# Altium project SolderStation.PrjPCB
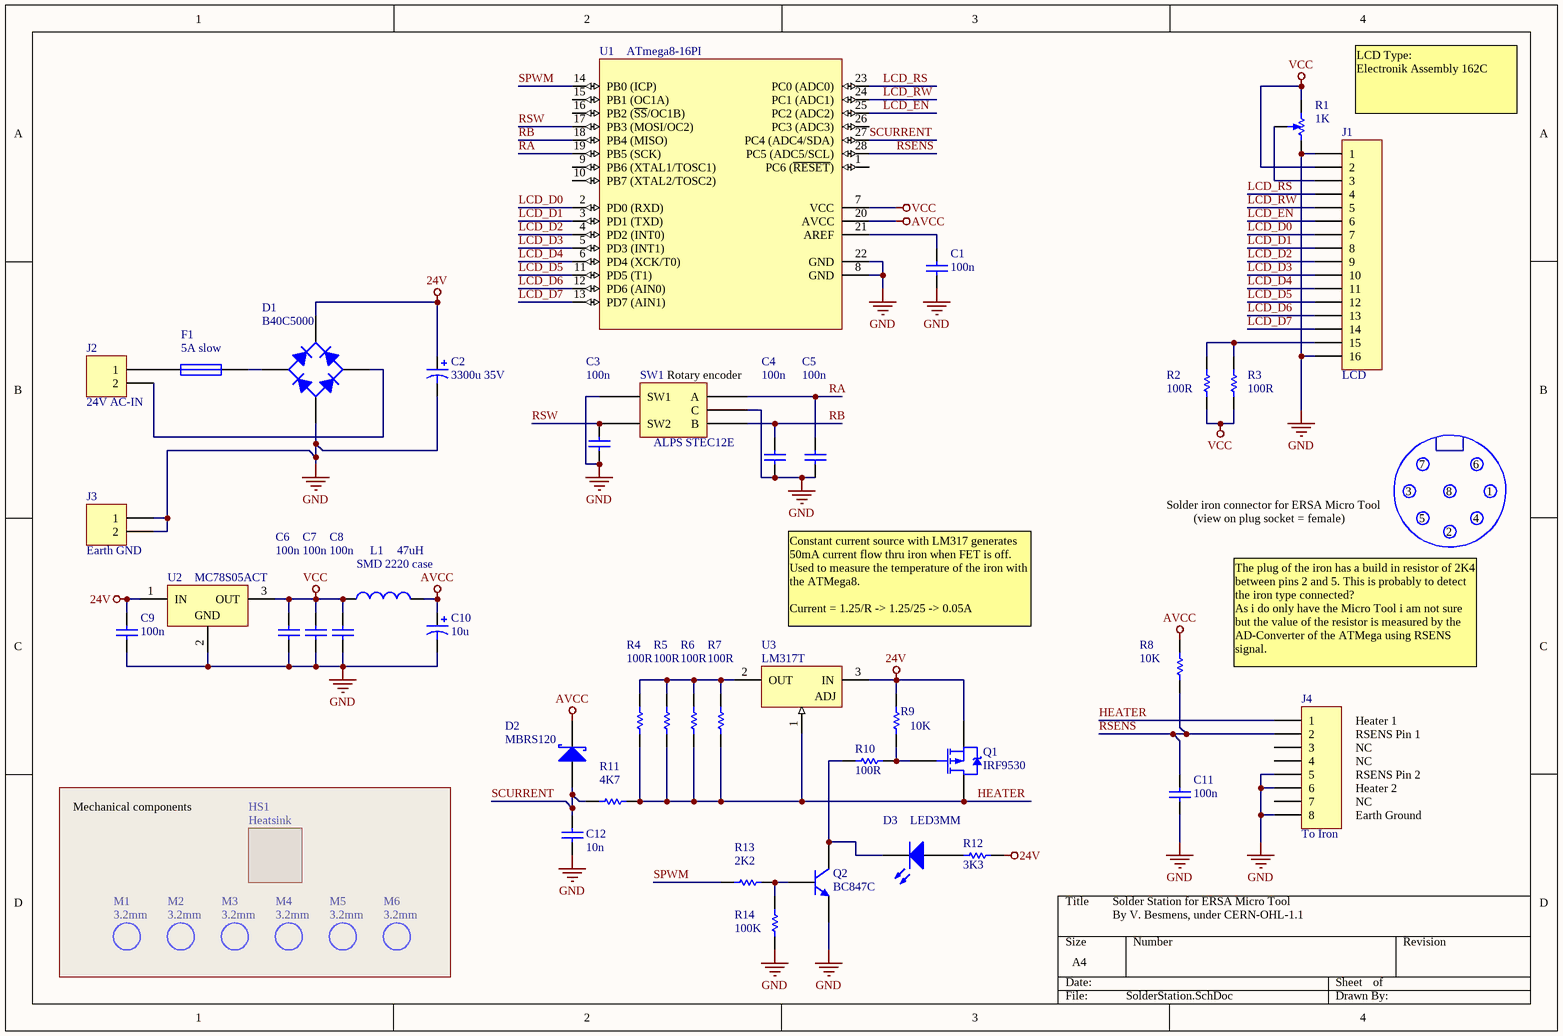
[diagram p0: SolderStation.SchDoc]
1 sheet, 48 parts. Net scope: global (net labels, ports and power ports of the same name join across sheets).
Board file: SoderStation.PcbDoc

## Sheet SolderStation.SchDoc
size A4

### Parts
C1  value 100n  [C0805]  (hidden comment: Cap Semi)
C2  3300u 35V  [RBM-3.5/8.0]
C3  value 100n  [C0805]  (hidden comment: Cap Semi)
C4  value 100n  [C0805]  (hidden comment: Cap Semi)
C5  value 100n  [C0805]  (hidden comment: Cap Semi)
C6  value 100n  [C0805]  (hidden comment: Cap Semi)
C7  value 100n  [C0805]  (hidden comment: Cap Semi)
C8  value 100n  [C0805]  (hidden comment: Cap Semi)
C9  value 100n  [C0805]  (hidden comment: Cap Semi)
C10  10u  [RBM-1.5/4.0]
C11  value 100n  [C0805]  (hidden comment: Cap Semi)
C12  value 10n  [C0805]  (hidden comment: Cap Semi)
D1  B40C5000  [BXXC5000]
D2  MBRS120  [D_SMB]
D3  LED3MM  [LED1206R]
F1  5A slow  [PIN-W2/E2.8]
HS1  Heatsink  [Heatsink_VPR116 - L46]
J1  LCD  [HDR1X16]
J2  24V AC-IN  [MKDS3_2RMI]
J3  Earth GND  [MKDS3_2RMI]
J4  To Iron  [PSS8G]
L1  value 47uH  [INDC1608L]  (hidden comment: 47u)
M1  3.2mm  [DRILL3_2MM]
M2  3.2mm  [DRILL3_2MM]
M3  3.2mm  [DRILL3_2MM]
M4  3.2mm  [DRILL3_2MM]
M5  3.2mm  [DRILL3_2MM]
M6  3.2mm  [DRILL3_2MM]
Q1  IRF9530  [TO-220-3VI]
Q2  BC847C  [SOT23]
R1  1K  [VR-7]
R2  value 100R  [R0805]  (hidden comment: Res1)
R3  value 100R  [R0805]  (hidden comment: Res1)
R4  value 100R  [R0805]  (hidden comment: Res1)
R5  value 100R  [R0805]  (hidden comment: Res1)
R6  value 100R  [R0805]  (hidden comment: Res1)
R7  value 100R  [R0805]  (hidden comment: Res1)
R8  value 10K  [R0805]  (hidden comment: Res1)
R9  value 10K  [R0805]  (hidden comment: Res1)
R10  value 100R  [R0805]  (hidden comment: Res1)
R11  value 4K7  [R0805]  (hidden comment: Res1)
R12  value 3K3  [R0805]  (hidden comment: Res1)
R13  value 2K2  [R0805]  (hidden comment: Res1)
R14  value 100K  [R0805]  (hidden comment: Res1)
SW1  ALPS STEC12E  [ALPS_STEC12E08]
U1  ATmega8-16PI  [DIP-28S]
U2  MC78S05ACT  [TO-220-3VI]
U3  LM317T  [TO220V]

### Blocks framed on the sheet
Mechanical components: HS1 M1-M6

### Nets
24V: C2.1 C9.2 D1.1(K) Q1.3(S) R9.2 R12.1 U2.1(IN) U3.3(IN)
AVCC: C10.1 D2.2(K) L1.2 R8.2 U1.20(AVCC)
GND: C1.1 C2.2 C3.1 C4.1 C5.1 C6.1 C7.1 C8.1 C9.1 C10.2 C11.1 C12.1 D1.3(A) J1.1 J1.16 J3.1 J3.2 J4.5 J4.6 J4.8 Q2.2(E) R1.3(+) R14.2 SW1.C SW1.SW1 U1.8(GND) U1.22(GND) U2.2(GND)
VCC: C6.2 C7.2 C8.2 J1.2 L1.1 R1.1(-) R2.2 R3.2 U1.7(VCC) U2.3(OUT)
HEATER: J4.1 Q1.2(D) R4.2 R5.2 R6.2 R7.2 R11.2 U3.1(ADJ)
LCD_D0: J1.7 U1.2(PD0_(RXD))
LCD_D1: J1.8 U1.3(PD1_(TXD))
LCD_D2: J1.9 U1.4(PD2_(INT0))
LCD_D3: J1.10 U1.5(PD3_(INT1))
LCD_D4: J1.11 U1.6(PD4_(XCK/T0))
LCD_D5: J1.12 U1.11(PD5_(T1))
LCD_D6: J1.13 U1.12(PD6_(AIN0))
LCD_D7: J1.14 U1.13(PD7_(AIN1))
LCD_EN: J1.6 U1.25(PC2_(ADC2))
LCD_RS: J1.4 U1.23(PC0_(ADC0))
LCD_RW: J1.5 U1.24(PC1_(ADC1))
RA: C5.2 SW1.A U1.19(PB5_(SCK))
RB: C4.2 SW1.B U1.18(PB4_(MISO))
RSENS: C11.2 J4.2 R8.1 U1.28(PC5_(ADC5/SCL))
RSW: C3.2 SW1.SW2 U1.17(PB3_(MOSI/OC2))
SCURRENT: C12.2 D2.1(A) R11.1 U1.27(PC4_(ADC4/SDA))
SPWM: R13.2 U1.14(PB0_(ICP))
NetC1_2: C1.2 U1.21(AREF)
NetD1_2: D1.2(C) J2.2
NetD1_4: D1.4(C) F1.2
NetD3_1: D3.1(A) R12.2
NetD3_2: D3.2(K) Q2.3(C) R10.2
NetF1_1: F1.1 J2.1
NetJ1_3: J1.3 R1.2(W)
NetJ1_15: J1.15 R2.1 R3.1
NetQ1_1: Q1.1(G) R9.1 R10.1
NetQ2_1: Q2.1(B) R13.1 R14.1
NetR4_1: R4.1 R5.1 R6.1 R7.1 U3.2(OUT)

Not connected (* = marked no-connect by the designer): J4 3 4 7; U1 1(PC6_(~{RESET})) 9(PB6_(XTAL1/TOSC1)) 10(PB7_(XTAL2/TOSC2)) 15(PB1_(OC1A)) 16(PB2_(~{SS}/OC1B)) 26(PC3_(ADC3))

### Notes on the sheet
- LCD Type:
  Electronik Assembly 162C
- (near SW1) Rotary encoder
- Solder iron connector for ERSA Micro Tool
- (view on plug socket = female)
- 3
- 5
- 7
- 8
- 4
- 6
- 1
- (near L1) SMD 2220 case
- 2
- Constant current source with LM317 generates 50mA current flow thru iron when FET is off. Used to measure the temperature of the iron with the ATMega8.
  Current = 1.25/R -> 1.25/25 -> 0.05A
- The plug of the iron has a build in resistor of 2K4 between pins 2 and 5. This is probably to detect the iron type connected?
  As i do only have the Micro Tool i am not sure but the value of the resistor is measured by the AD-Converter of the ATMega using RSENS signal.
- Heater 1
- RSENS Pin 1
- RSENS Pin 2
- NC
- Heater 2
- Earth Ground
- Solder Station for ERSA Micro Tool
- By V. Besmens, under CERN-OHL-1.1
- Title
- Size:
- Date:
- A4
- Number:
- Time:
- Revision:
- Sheet
- of
- File:

### Library data of the parts
C1 C3-C9 C11 C12 = Cap Semi: Capacitor (Semiconductor SIM Model); Published: 8-Jun-2000; LatestRevisionDate: 29-May-2009; LatestRevisionNote: IPC-7351 Footprint Added.; PackageReference: C1206; Publisher: Altium Limited; PackageDescription: Chip Capacitor
C2 C10 = Cap Pol3: Polarized Capacitor (Surface Mount); Published: 8-Jun-2000; LatestRevisionDate: 29-May-2009; LatestRevisionNote: IPC-7351 Footprint Added.; PackageReference: C0805; Publisher: Altium Limited; PackageDescription: Chip Capacitor
  C2: Value: 3300u 35V
  C10: Value: 10u
D1 = Bridge1: Full Wave Diode Bridge; Published: 8-Jun-2000; LatestRevisionDate: 29-May-2009; LatestRevisionNote: Sch pins A & K swapped.; DatasheetVersion: E2732B; PackageReference: D-38; Publisher: Altium Limited; PackageDescription: Bridge Rectifier; 4 Terminals; Body 9.4 x 9.4 mm (typ); Pitch 5.08 mm
D2 = D Schottky: Schottky Diode; Published: 8-Jun-2000; LatestRevisionDate: 17-Jul-2002; LatestRevisionNote: Re-released for DXP Platform.; PackageReference: SMB; Publisher: Altium Limited; Code_JEDEC: DO-214-AA
D3 = LED0: Typical INFRARED GaAs LED; Published: 8-Jun-2000; LatestRevisionDate: 08-Jul-2005; LatestRevisionNote: Mech Layer 1 removed.; PackageReference: LED-0; Publisher: Altium Limited; PackageDescription: LED; 2 Leads
F1 = Fuse 1: Fuse; Published: 8-Jun-2000; LatestRevisionDate: 17-Jul-2002; LatestRevisionNote: Re-released for DXP Platform.; PackageReference: PIN-W2/E2.8; Publisher: Altium Limited; PackageDescription: Thru-Hole; 2 Leads
HS1 = Heatsink: Heatsink Symbol
J1 = Header 16: Header, 16-Pin; LatestRevisionDate: 17-Jul-2002; LatestRevisionNote: Re-released for DXP Platform.; Publisher: Altium Limited
J2 J3 = Header 2: Header, 2-Pin; LatestRevisionDate: 17-Jul-2002; LatestRevisionNote: Re-released for DXP Platform.; Publisher: Altium Limited
J4 = Header 8: Header, 8-Pin; LatestRevisionDate: 17-Jul-2002; LatestRevisionNote: Re-released for DXP Platform.; Publisher: Altium Limited
L1 = Inductor: Code_IEC: 1005; Published: 8-Jun-2000; LatestRevisionDate: 29-May-2009; LatestRevisionNote: IPC-7351 Footprint Added.; PackageReference: 0402-A; Publisher: Altium Limited; PackageDescription: Chip Inductor; Code_JEITA: 0402
M1-M6 = MountingHole: Mounting Hole
Q1 = IRF9530: HEXFET P-Channel Power MOSFET; Note: Pin 2 is electrically connected to pin 4.; Published: 8-Jun-2000; LatestRevisionDate: 17-Jul-2002; LatestRevisionNote: Re-released for DXP Platform.; DatasheetVersion: PD-9.320G; PackageVersion: Feb-1997; PackageReference: TO-220AB; Publisher: Altium Limited; PackageDescription: TO, Thru-Hole, Vertical, Heatsink Mounted; 3 In-Line Leads; Pitch 2.54 mm; ComponentLink1Description: Manufacturer Link; ComponentLink1URL: http://www.irf.com/; ComponentLink2Description: Datasheet; ComponentLink2URL: http://www.irf.com/product-info/datasheets/data/irf9530.pdf
Q2 = BC847C: NPN General-purpose Transistor; Published: 17-Sep-2003; LatestRevisionDate: 12-Dec-2006; LatestRevisionNote: IPC-7351 Footprint Added.; DatasheetVersion: 4-Feb-2002; PackageVersion: May-1999; PackageReference: SOT23; Publisher: Altium Limited; PackageDescription: 3-Pin SOT-23 Package 0.95 mm Pitch, 2.3 mm Lead Span; ComponentLink1Description: Manufacturer Link; ComponentLink1URL: http://www.semiconductors.philips.com/; ComponentLink2Description: Datasheet; ComponentLink2URL: http://www.semiconductors.philips.com/acrobat/datasheets/BC846_BC847_BC848_5.pdf
R1 = RPot SM: Square Trimming Potentiometer; Published: 17-Dec-2003; DatasheetVersion: Oct-2003; PackageReference: POT4MM-2; Publisher: Altium Limited; ComponentLink1Description: Manufacturer Link; ComponentLink1URL: http://bourns.com/2/search.html
R2-R14 = Res1: Resistor; Published: 8-Jun-2000; LatestRevisionDate: 17-Jul-2002; LatestRevisionNote: Re-released for DXP Platform.; PackageReference: AXIAL-0.3; Publisher: Altium Limited
SW1 = RotaryEncoder
U1 = ATmega8-16PI: 8-Bit AVR Microcontroller with 8K Bytes of In-System Programmable Flash Memory; Published: 17-Sep-2003; LatestRevisionDate: 04-Mar-2005; LatestRevisionNote: Stylized 3D Model Added.; DatasheetVersion: 2486H-AVR-09/02; PackageVersion: revB, Sep-2001; PackageReference: 28P3; Publisher: Altium Limited; PackageDescription: DIP; 28 Leads; Row Spacing 7.62 mm; Pitch 2.54 mm; ComponentLink1Description: Manufacturer Link; ComponentLink1URL: http://www.atmel.com; ComponentLink2Description: Datasheet; ComponentLink2URL: http://www.atmel.com/dyn/resources/prod_documents/doc2486.pdf
U2 = MC7805ACT: 3-Terminal Positive Fixed Voltage Regulator; Note: Pin 2 is electrically connected to TAB; Published: 17-Jul-2002; DatasheetVersion: 1988; PackageReference: 221A-04; Publisher: Altium Limited; PackageDescription: TO, Thru-Hole, Vertical, Heatsink Mounted; 3 In-Line Leads; Pitch 2.54 mm; Code_JEDEC: TO-262-AA; ComponentLink1Description: Manufacturer Link; ComponentLink1URL: http://www.onsemi.com/site/products/taxonomy/0,4438,503,00.html; ComponentLink2Description: Datasheet; ComponentLink2URL: http://www.onsemi.com/pub/Collateral/MC7800-D.PDF
U3 = LM317T: 3-Terminal Adjustable Positive Voltage Regulator; Note: Heatsink surface connected to pin 2.; Published: 17-Jul-2002; DatasheetVersion: 1988; PackageReference: 221A-04; Publisher: Altium Limited; PackageDescription: TO, Thru-Hole, Vertical, Heatsink Mounted; 3 In-Line Leads; Pitch 2.54 mm; Code_JEDEC: TO-262-AA; ComponentLink1Description: Manufacturer Link; ComponentLink1URL: http://www.onsemi.com/site/products/taxonomy/0,4438,503,00.html; ComponentLink2Description: Datasheet; ComponentLink2URL: http://www.onsemi.com/pub/Collateral/LM317-D.PDF